# EAGLE design MIDI_Lighter_Multi-Voltage (EAGLE 7.6.0)

## Sheet 1 of 4: POWER SUPPLY
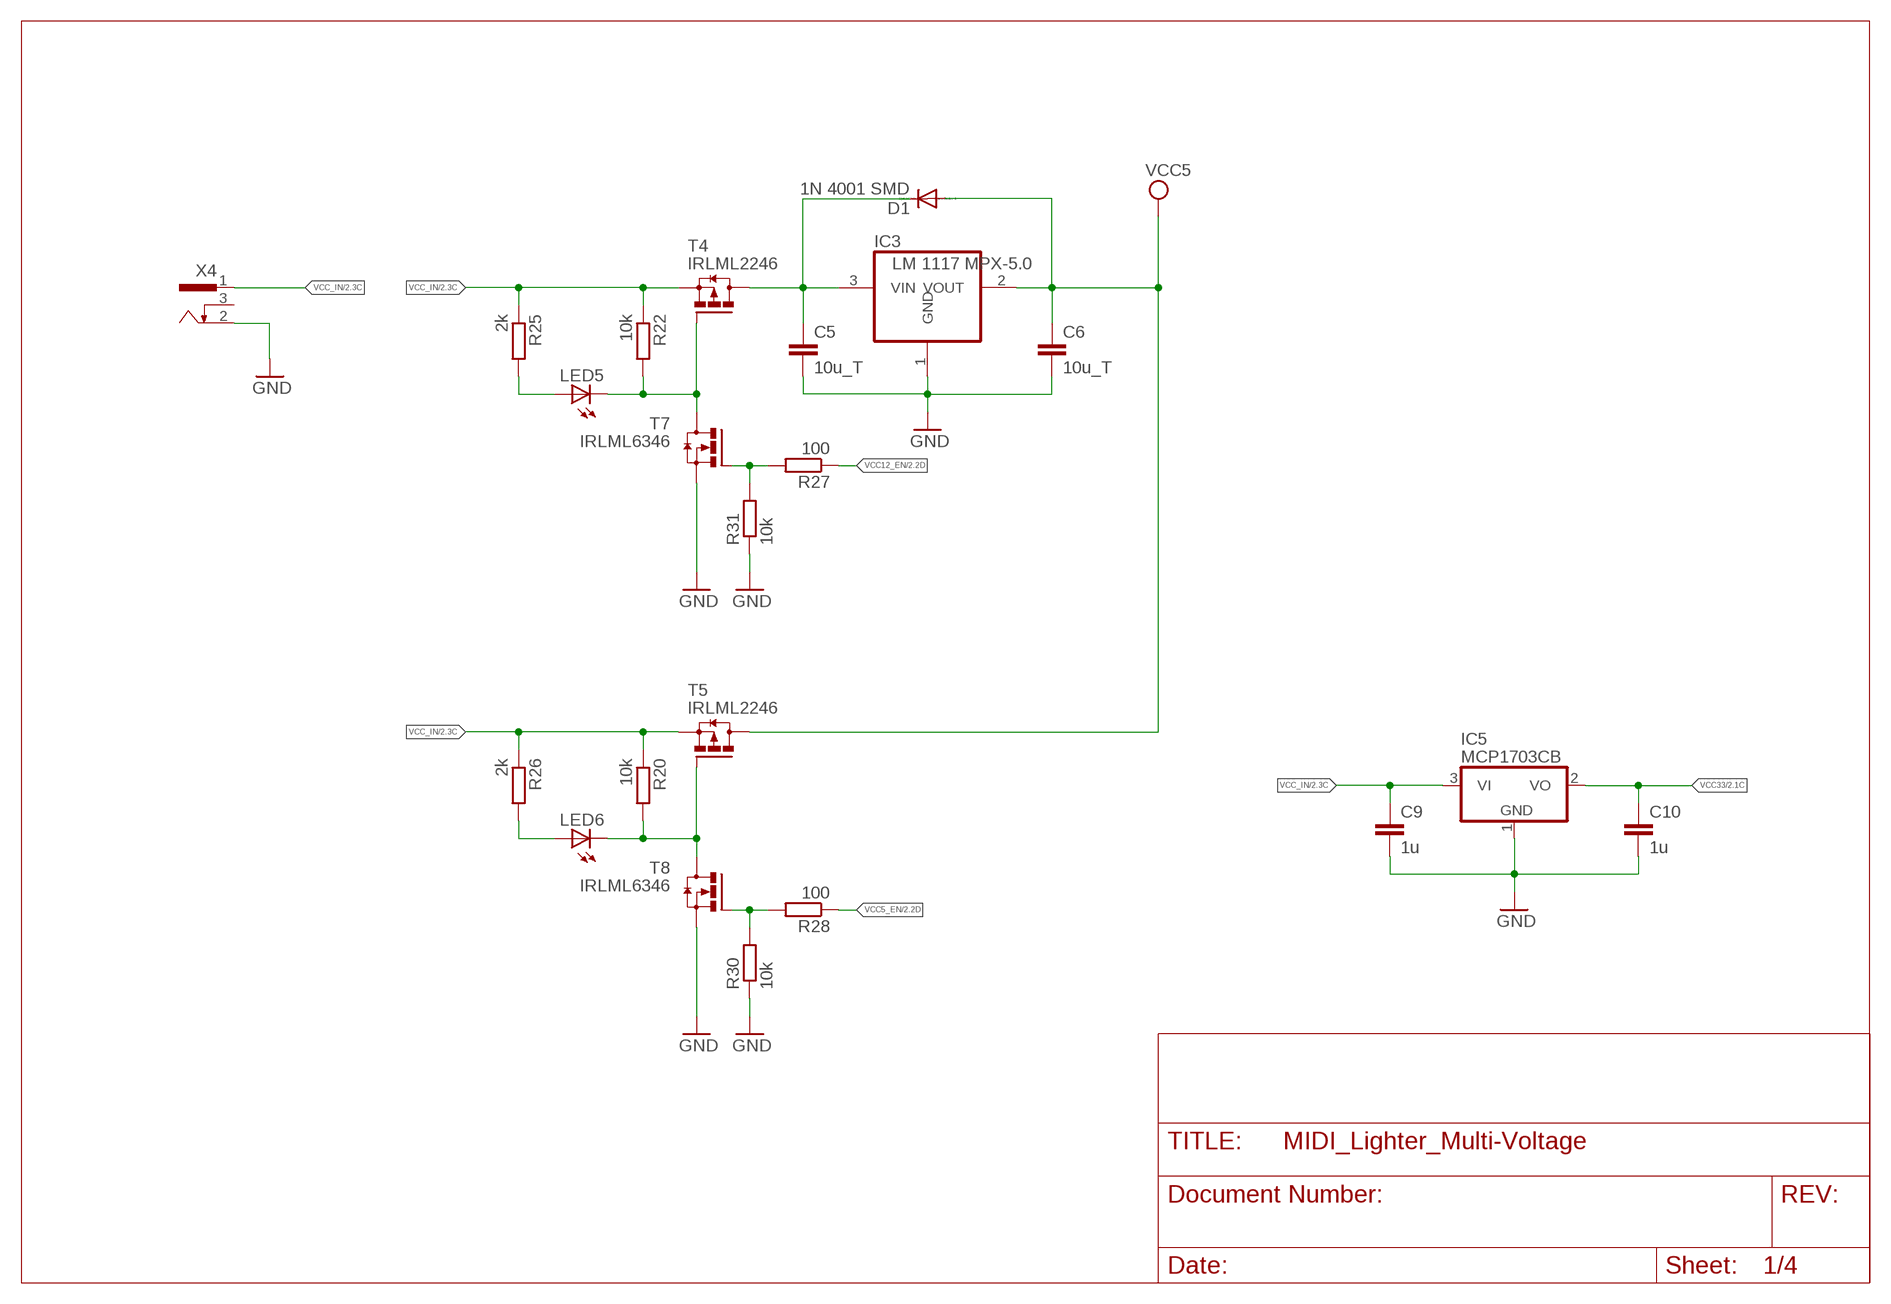
[diagram p0: schematic, sheet 1]

### Parts
C5  10u_T  C-EUC1210  [C1210]
C6  10u_T  C-EUC1210  [C1210]
C9  1u  C-EUC0805  [C0805]
C10  1u  C-EUC0805  [C0805]
D1  1N 4001 SMD  DIODE-MINIMELF  [MINIMELF]
IC3  LM 1117 MPX-5.0  REG1117  [SOT223]
IC5  MCP1703CB  [SOT23]
LED5  LEDCHIP-LED0805  [CHIP-LED0805]
LED6  LEDCHIP-LED0805  [CHIP-LED0805]
R20  10k  R-EU_R0805  [R0805]
R22  10k  R-EU_R0805  [R0805]
R25  2k  R-EU_R0805  [R0805]
R26  2k  R-EU_R0805  [R0805]
R27  100  R-EU_R0805  [R0805]
R28  100  R-EU_R0805  [R0805]
R30  10k  R-EU_R0805  [R0805]
R31  10k  R-EU_R0805  [R0805]
T4  IRLML2246  [SOT23]
T5  IRLML2246  [SOT23]
T7  IRLML6346  [SOT23]
T8  IRLML6346  [SOT23]
X4  733980-62  [733980-62]

### Nets
GND: C5.2 C6.2 C9.2 C10.2 IC3.1(GND) IC5.1(GND) R30.1 R31.1 T7.2(S) T8.2(S) X4.2 ; also sheet 2,3,4
N$9: C5.1 D1.C IC3.3(VIN) T4.3(D)
N$33: LED5.C R22.2 T4.1(G) T7.3(D)
N$35: LED6.C R20.2 T5.1(G) T8.3(D)
N$36: LED6.A R26.2
N$37: LED5.A R25.2
N$38: R27.2 R31.2 T7.1(G)
N$39: R28.2 R30.2 T8.1(G)
VCC: C6.1 D1.A IC3.2(VOUT) T5.3(D) ; supply symbol labelled VCC5 ; also sheet 2,3
VCC5_EN: R28.1 ; also sheet 2
VCC12_EN: R27.1 ; also sheet 2
VCC33: C10.1 IC5.2(VO) ; also sheet 2
VCC_IN: C9.1 IC5.3(VI) R20.1 R22.1 R25.1 R26.1 T4.2(S) T5.2(S) X4.1 ; also sheet 2,4
Unconnected: X4.3

## Sheet 2 of 4: MCU
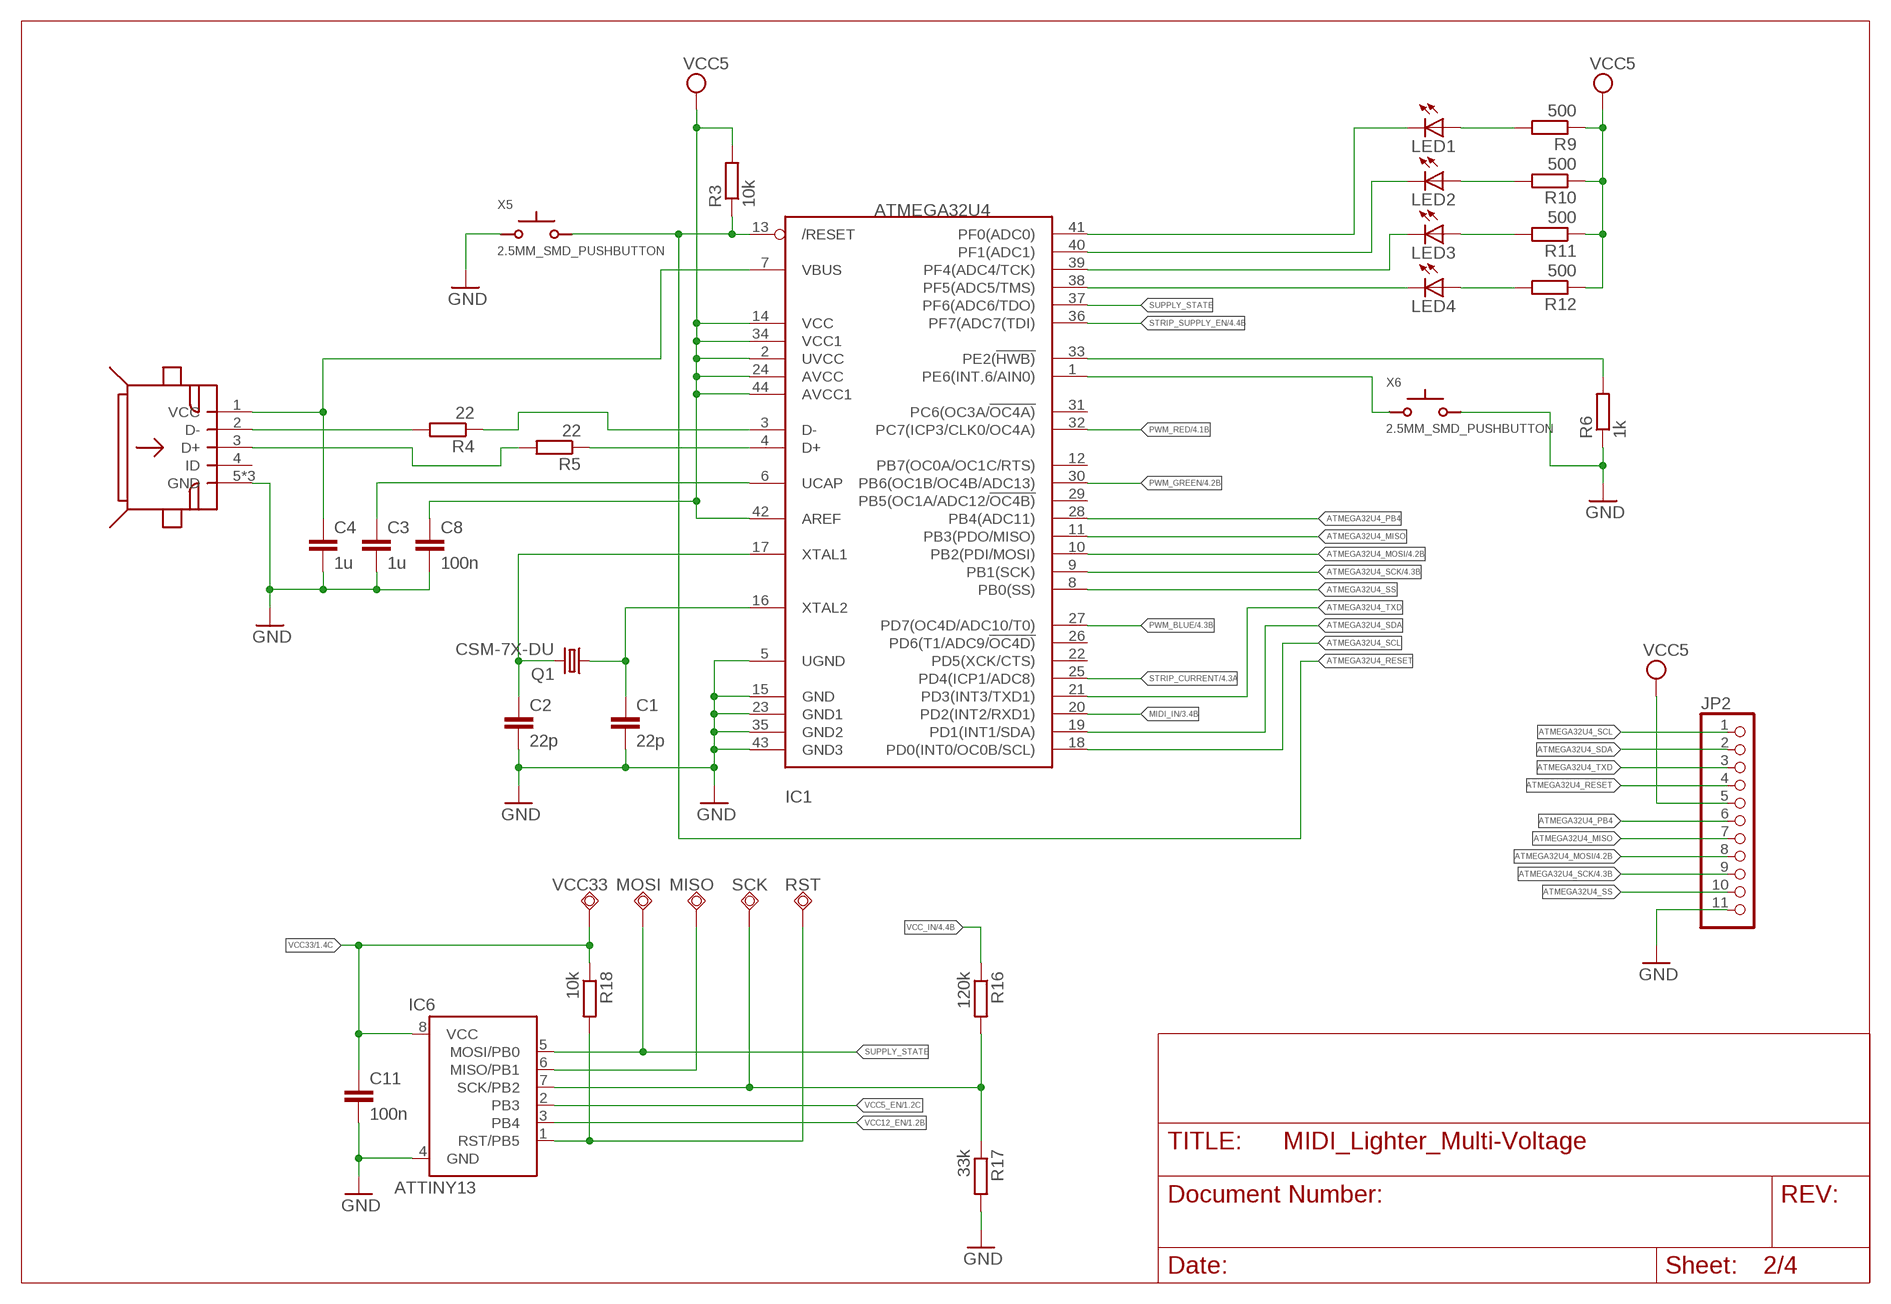
[diagram p1: schematic, sheet 2]

### Parts
C1  22p  C-EUC0805  [C0805]
C2  22p  C-EUC0805  [C0805]
C3  1u  C-EUC0805  [C0805]
C4  1u  C-EUC0805  [C0805]
C8  100n  C-EUC0805  [C0805]
C11  100n  C-EUC0805  [C0805]
IC1  ATMEGA32U4  [TQFP44]
IC6  ATTINY13  [SO08]
JP2  PINHD-1X11  [1X11]
LED1  LEDCHIP-LED0805  [CHIP-LED0805]
LED2  LEDCHIP-LED0805  [CHIP-LED0805]
LED3  LEDCHIP-LED0805  [CHIP-LED0805]
LED4  LEDCHIP-LED0805  [CHIP-LED0805]
MISO  TPSQTP13R  [TP13R]
MOSI  TPSQTP13R  [TP13R]
Q1  CSM-7X-DU  [CSM-7X-DU]
R3  10k  R-EU_R0805  [R0805]
R4  22  R-EU_R0805  [R0805]
R5  22  R-EU_R0805  [R0805]
R6  1k  R-EU_R0805  [R0805]
R9  500  R-EU_R0805  [R0805]
R10  500  R-EU_R0805  [R0805]
R11  500  R-EU_R0805  [R0805]
R12  500  R-EU_R0805  [R0805]
R16  120k  R-EU_R0805  [R0805]
R17  33k  R-EU_R0805  [R0805]
R18  10k  R-EU_R0805  [R0805]
RST  TPSQTP13R  [TP13R]
SCK  TPSQTP13R  [TP13R]
VCC33  TPSQTP13R  [TP13R]
X3  USB_MICRO_BUCHSE_LCSC  [USB_MICRO_BUCHSE_LCSC]
X5  2.5MM_SMD_PUSHBUTTON  [2.5MM_SMD_PUSHBUTTON]
X6  2.5MM_SMD_PUSHBUTTON  [2.5MM_SMD_PUSHBUTTON]

### Nets
ATMEGA32U4_MISO: IC1.11(PB3(PDO/MISO)) JP2.7
ATMEGA32U4_MOSI: IC1.10(PB2(PDI/MOSI)) JP2.8 ; also sheet 4
ATMEGA32U4_PB4: IC1.28(PB4(ADC11)) JP2.6
ATMEGA32U4_RESET: IC1.13(/RESET) JP2.4 R3.1 X5.2
ATMEGA32U4_SCK: IC1.9(PB1(SCK)) JP2.9 ; also sheet 4
ATMEGA32U4_SCL: IC1.18(PD0(INT0/OC0B/SCL)) JP2.1
ATMEGA32U4_SDA: IC1.19(PD1(INT1/SDA)) JP2.2
ATMEGA32U4_SS: IC1.8(PB0(SS)) JP2.10
ATMEGA32U4_TXD: IC1.21(PD3(INT3/TXD1)) JP2.3
GND: C1.2 C2.2 C3.2 C4.2 C8.2 C11.2 IC1.5(UGND) IC1.15(GND) IC1.23(GND1) IC1.35(GND2) IC1.43(GND3) IC6.4(GND) JP2.11 R6.1 R17.2 X3.5(GND) X3.GND1(GND) X3.GND2(GND) X5.1 X6.2 ; also sheet 1,3,4
MIDI_IN: IC1.20(PD2(INT2/RXD1)) ; also sheet 3
N$4: R4.2 X3.2(D-)
N$5: IC1.3(D-) R4.1
N$6: C1.1 IC1.16(XTAL2) Q1.1
N$7: C2.1 IC1.17(XTAL1) Q1.2
N$8: C3.1 IC1.6(UCAP)
N$10: R5.2 X3.3(D+)
N$11: IC1.4(D+) R5.1
N$12: IC1.33(PE2(!HWB)) R6.2
N$17: IC1.41(PF0(ADC0)) LED1.C
N$18: IC1.40(PF1(ADC1)) LED2.C
N$19: IC1.39(PF4(ADC4/TCK)) LED3.C
N$20: IC1.38(PF5(ADC5/TMS)) LED4.C
N$22: IC1.1(PE6(INT.6/AIN0)) X6.1
N$25: LED1.A R9.2
N$26: LED2.A R10.2
N$27: LED3.A R11.2
N$28: LED4.A R12.2
N$34: IC6.1(RST/PB5) R18.2 RST.TP
N$47: IC6.6(MISO/PB1) MISO.TP
PWM_BLUE: IC1.27(PD7(OC4D/ADC10/T0)) ; also sheet 4
PWM_GREEN: IC1.30(PB6(OC1B/OC4B/ADC13)) ; also sheet 4
PWM_RED: IC1.32(PC7(ICP3/CLK0/OC4A)) ; also sheet 4
STRIP_CURRENT: IC1.25(PD4(ICP1/ADC8)) ; also sheet 4
STRIP_SUPPLY_EN: IC1.36(PF7(ADC7(TDI)) ; also sheet 4
SUPPLY_STATE: IC1.37(PF6(ADC6/TDO)) IC6.5(MOSI/PB0) MOSI.TP
VCC: C8.1 IC1.2(UVCC) IC1.14(VCC) IC1.24(AVCC) IC1.34(VCC1) IC1.42(AREF) IC1.44(AVCC1) JP2.5 R3.2 R9.1 R10.1 R11.1 R12.1 ; supply symbol labelled VCC5 ; also sheet 1,3
VCC5_EN: IC6.2(PB3) ; also sheet 1
VCC12_EN: IC6.3(PB4) ; also sheet 1
VCC33: C11.1 IC6.8(VCC) R18.1 VCC33.TP ; also sheet 1
VCC_IN: R16.1 ; also sheet 1,4
VCC_USB: C4.1 IC1.7(VBUS) X3.1(VCC)
VOLTAGE_READ: IC6.7(SCK/PB2) R16.2 R17.1 SCK.TP
Unconnected: IC1.12(PB7(OC0A/OC1C/RTS)) IC1.22(PD5(XCK/CTS)) IC1.26(PD6(T1/ADC9/!OC4D)) IC1.29(PB5(OC1A/ADC12/!OC4B)) IC1.31(PC6(OC3A/!OC4A)) X3.4(ID)

## Sheet 3 of 4: MIDI
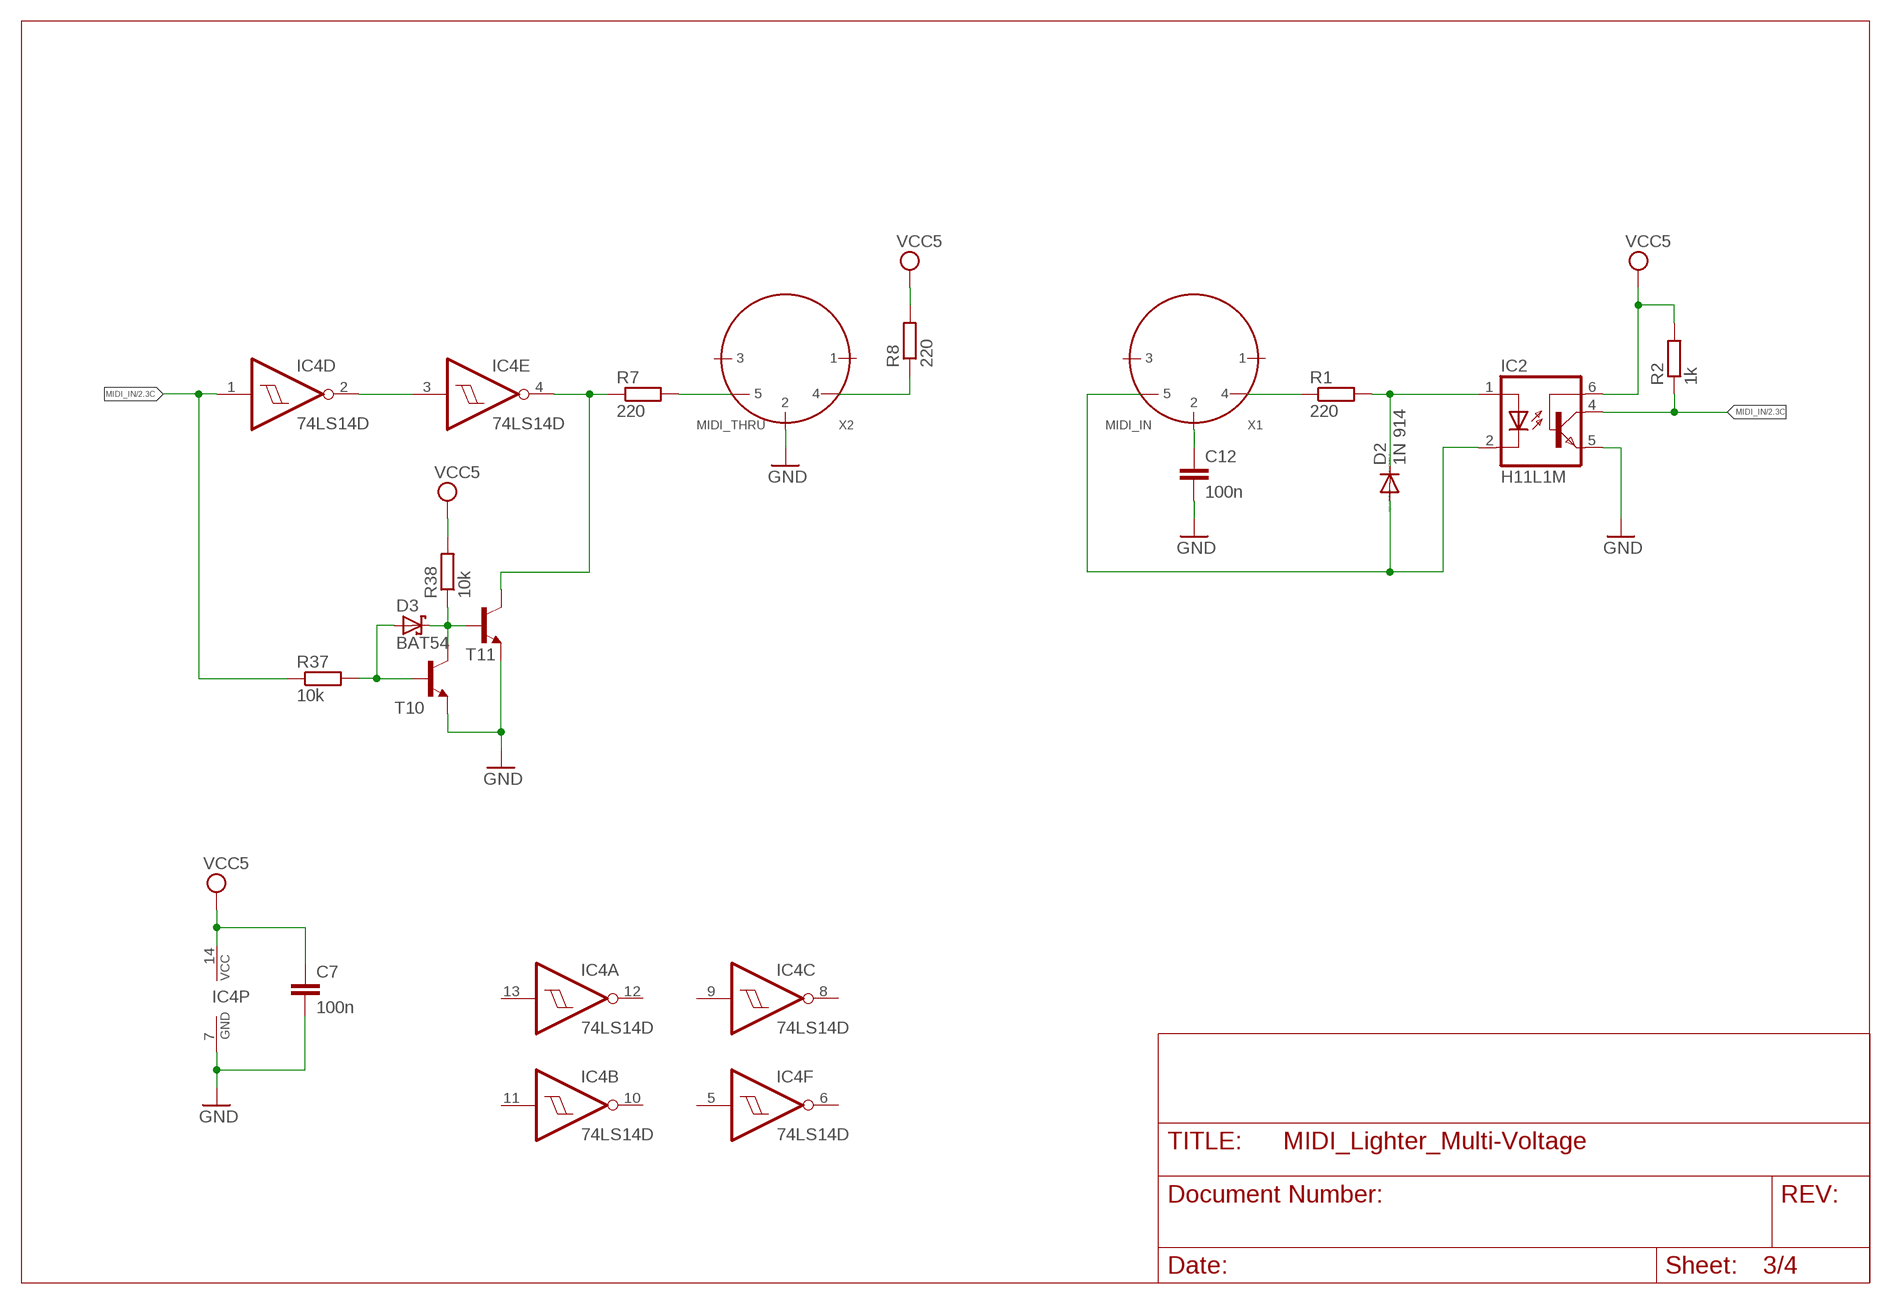
[diagram p2: schematic, sheet 3]

### Parts
C7  100n  C-EUC0805  [C0805]
C12  100n  C-EUC0805  [C0805]
D2  1N 914  DIODE-DO35-10  [DO35-10]
D3  BAT54  [SOT23]
IC2  H11L1M  [DIL06]
IC4  74LS14D  [SO14]
R1  220  R-EU_R0805  [R0805]
R2  1k  R-EU_R0805  [R0805]
R7  220  R-EU_R0805  [R0805]
R8  220  R-EU_R0805  [R0805]
R37  10k  R-EU_R0805  [R0805]
R38  10k  R-EU_R0805  [R0805]
T10  BC847CLT1-NPN-SOT23-BEC  [SOT23-BEC]
T11  BC847CLT1-NPN-SOT23-BEC  [SOT23-BEC]
X1  MIDI_IN  DIN_PLUG_5_PINS  [DIN_PLUG_5_PINS]
X2  MIDI_THRU  DIN_PLUG_5_PINS  [DIN_PLUG_5_PINS]

### Nets
GND: C7.2 C12.2 IC2.5(GND) IC4.7(P:GND) T10.E T11.E X2.2 ; also sheet 1,2,4
MIDI_IN: IC2.4(VO) IC4.1(D:I) R2.1 R37.1 ; also sheet 2
N$1: D2.C IC2.1(A) R1.2
N$2: R1.1 X1.4
N$3: D2.A IC2.2(C) X1.5
N$13: IC4.2(D:O) IC4.3(E:I)
N$15: R7.2 X2.5
N$16: R8.1 X2.4
N$40: C12.1 X1.2
N$44: D3.1(A) R37.2 T10.B
N$46: D3.3(C) R38.1 T10.C T11.B
N$49: IC4.4(E:O) R7.1 T11.C
VCC: C7.1 IC2.6(VCC) IC4.14(P:VCC) R2.2 R8.2 R38.2 ; supply symbol labelled VCC5 ; also sheet 1,2
Unconnected: IC4.5(F:I) IC4.6(F:O) IC4.8(C:O) IC4.9(C:I) IC4.10(B:O) IC4.11(B:I) IC4.12(A:O) IC4.13(A:I) X1.1 X1.3 X2.1 X2.3

## Sheet 4 of 4
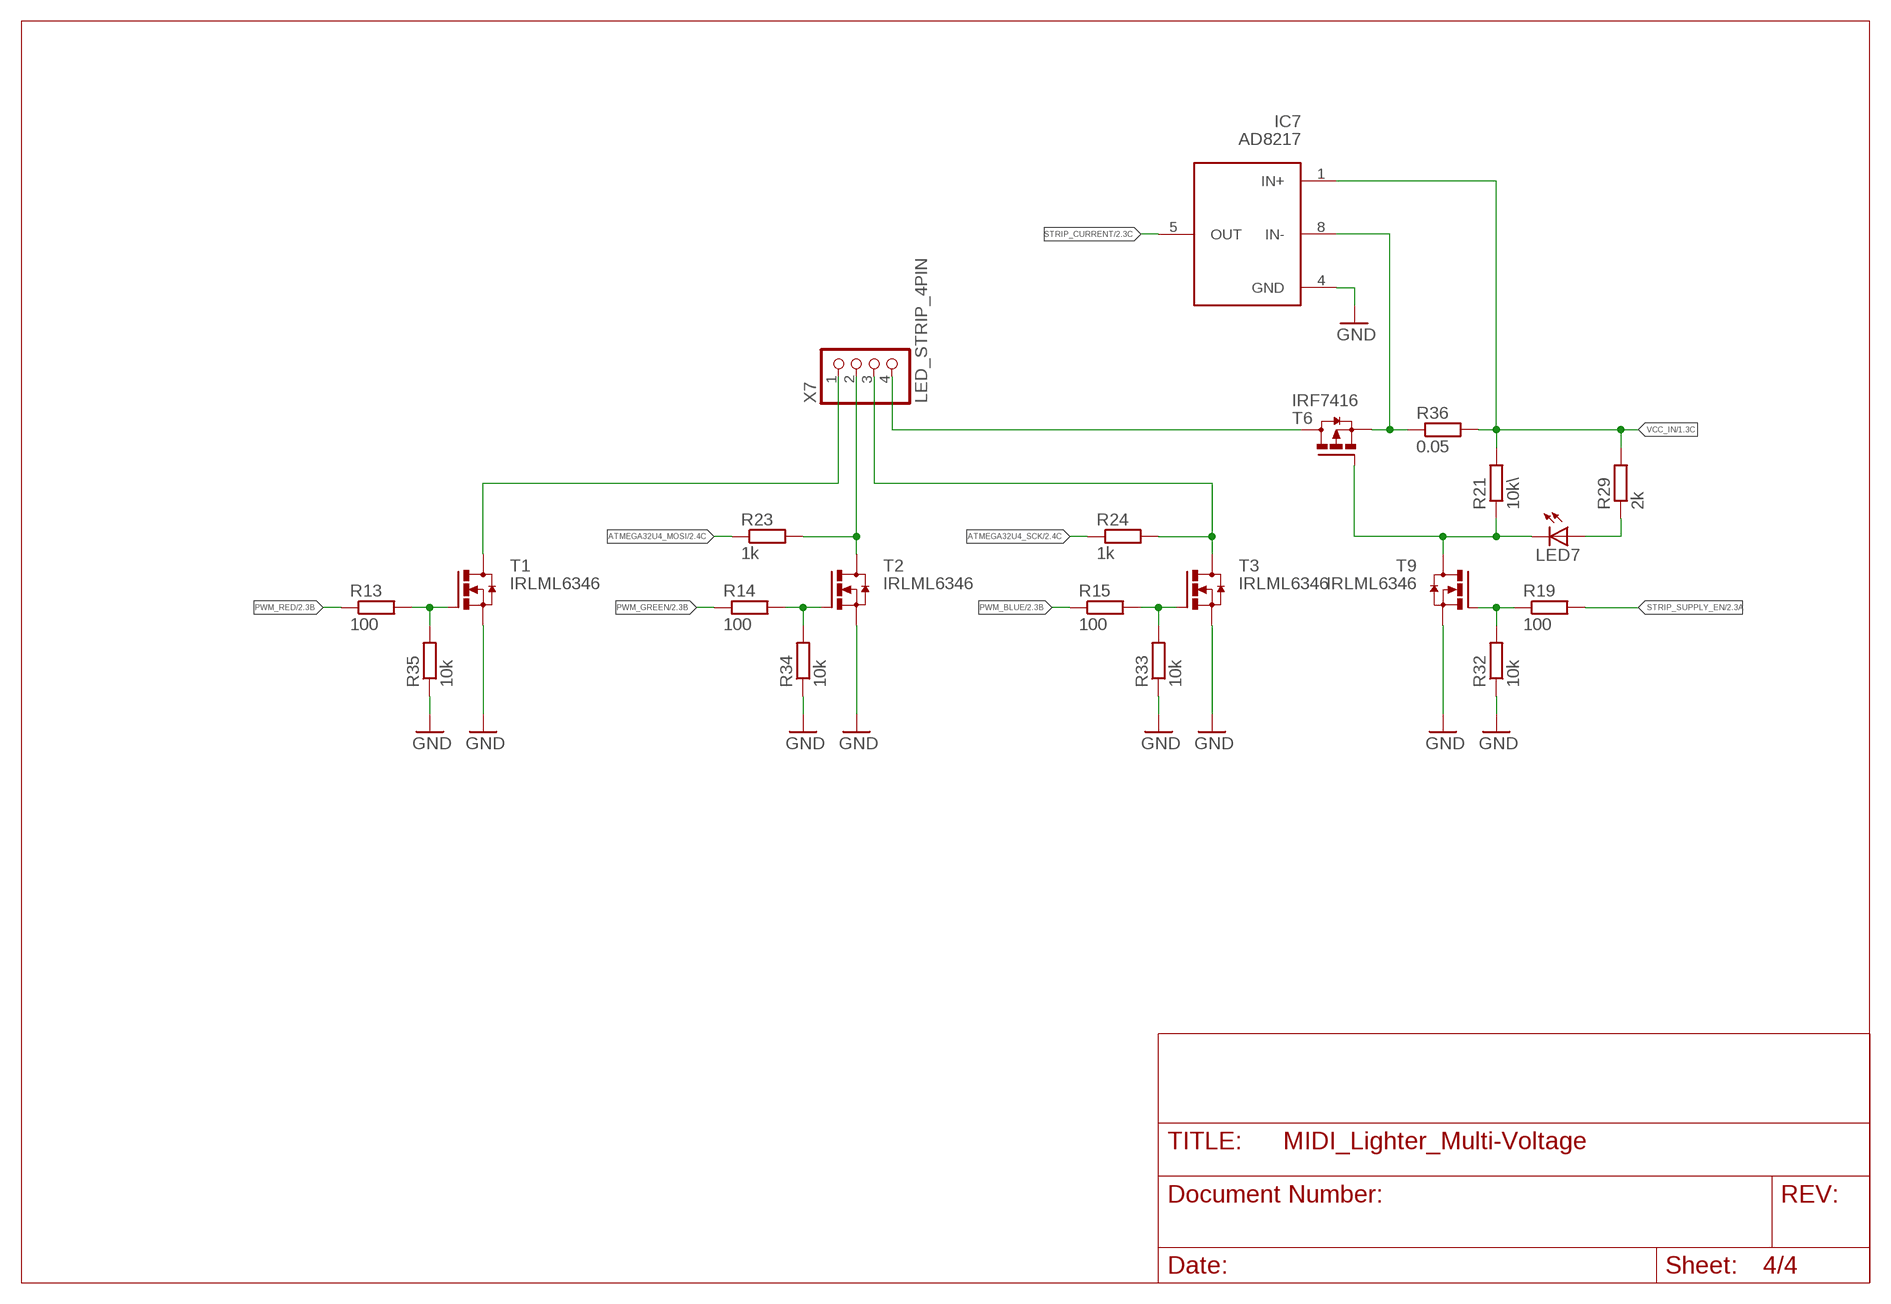
[diagram p3: schematic, sheet 4]

### Parts
IC7  AD8217  [SO08]
LED7  LEDCHIP-LED0805  [CHIP-LED0805]
R13  100  R-EU_R0805  [R0805]
R14  100  R-EU_R0805  [R0805]
R15  100  R-EU_R0805  [R0805]
R19  100  R-EU_R0805  [R0805]
R21  10k\  R-EU_R0805  [R0805]
R23  1k  R-EU_R0805  [R0805]
R24  1k  R-EU_R0805  [R0805]
R29  2k  R-EU_R0805  [R0805]
R32  10k  R-EU_R0805  [R0805]
R33  10k  R-EU_R0805  [R0805]
R34  10k  R-EU_R0805  [R0805]
R35  10k  R-EU_R0805  [R0805]
R36  0.05  R-EU_R2512  [R2512]
T1  IRLML6346  [SOT23]
T2  IRLML6346  [SOT23]
T3  IRLML6346  [SOT23]
T6  IRF7416  [SO08]
T9  IRLML6346  [SOT23]
X7  LED_STRIP_4PIN  [LED_STRIP_4PIN]

### Nets
ATMEGA32U4_MOSI: R23.1 ; also sheet 2
ATMEGA32U4_SCK: R24.1 ; also sheet 2
GND: IC7.4(GND) R32.1 R33.1 R34.1 R35.1 T1.2(S) T2.2(S) T3.2(S) T9.2(S) ; also sheet 1,2,3
N$21: R13.2 R35.2 T1.1(G)
N$23: R14.2 R34.2 T2.1(G)
N$24: R15.2 R33.2 T3.1(G)
N$29: R23.2 T2.3(D) X7.2
N$30: T1.3(D) X7.1
N$31: R24.2 T3.3(D) X7.3
N$32: T6.5(D) T6.6(D) T6.7(D) T6.8(D) X7.4
N$41: LED7.C R21.1 T6.4(G) T9.3(D)
N$42: R19.1 R32.2 T9.1(G)
N$43: LED7.A R29.1
N$45: IC7.8(IN-) R36.1 T6.1(S) T6.2(S) T6.3(S)
PWM_BLUE: R15.1 ; also sheet 2
PWM_GREEN: R14.1 ; also sheet 2
PWM_RED: R13.1 ; also sheet 2
STRIP_CURRENT: IC7.5(OUT) ; also sheet 2
STRIP_SUPPLY_EN: R19.2 ; also sheet 2
VCC_IN: IC7.1(IN+) R21.2 R29.2 R36.2 ; also sheet 1,2

## Library data of the parts
C1-C4 C7-C12 = resistor:C-EU: CAPACITOR, European symbol
C5 C6 = resistor:C-EU: CAPACITOR, European symbol; REICHELT: TPS 3225 10/20
D1 D2 = diode:DIODE-: DIODE
D3 = diode:BAT54: Schottky Diodes Source: Fairchild .. BAT54.pdf
IC1 = ChrosLib:ATMEGA32U4; REICHELT: ATXMEGA 32A4U-AU
IC2 = ChrosLib:H11L1M
IC3 = burr-brown:REG1117: 800mA and 1A Low Dropout (LDO) Positive Regulator 1.8V, 2.5V, 2.85V, 3.3V, 5V, and Adj; MPN: REG1117; OC_FARNELL: 1097566; OC_NEWARK: 14P6981
IC4 = 74xx-eu:74*14: Hex schmitt trigger INVERTER
IC5 = linear:MCP1703: 250 mA, 16V, Low Quiescent Current LDO Regulator Source: http://ww1.microchip.com/downloads/en/DeviceDoc/22049b.pdf
IC6 = ChrosLib:ATTINY13; REICHELT: ATTINY 13A-SSU
IC7 = ChrosLib:AD8217
JP2 = pinhead:PINHD-1X11: PIN HEADER
LED1-LED7 = led:LED: LED OSRAM: - CHIPLED LG R971, LG N971, LY N971, LG Q971, LY Q971, LO R971, LY R971 LH N974, LH R974 LS Q976, LO Q976, LY Q976 LO Q996 - Hyper CHIPLED LW Q18S LB Q993, LB Q99A, LB R99A - SideLED LS A670, LO A670, LY A670, LG A670, LP A670 LB A673, LV A673, LT A673, LW A673 LH A674 LY A675 LS A676, LA A676, LO A676, LY A676, LW A676 LS A679, LY A679, LG A679 - Hyper Micro SIDELED® LS Y876, LA Y876, LO Y876, LY Y876 LT Y87S - SmartLED LW L88C, LW L88S LB L89C, LB L89S, LG L890 LS L89K, LO L89K, LY L89K LS L896, LA L896, LO L896, LY L896 - TOPLED LS T670, LO T670, LY T670, LG T670, LP T670 LSG T670, LSP T670, LSY T670, LOP T670, LYG T670 LG T671, LOG T671, LSG T671 LB T673, LV T673, LT T673, LW T673 LH T674 LS T676, LA T676, LO T676, LY T676, LB T676, LH T676, LSB T676, LW T676 LB T67C, LV T67C, LT T67C, LS T67K, LO T67K, LY T67K, LW E67C LS E67B, LA E67B, LO E67B, LY E67B, LB E67C, LV E67C, LT E67C LW T67C LS T679, LY T679, LG T679 LS T770, LO T770, LY T770, LG T770, LP T770 LB T773, LV T773, LT T773, LW T773 LH T774 LS E675, LA E675, LY E675, LS T675 LS T776, LA T776, LO T776, LY T776, LB T776 LHGB T686 LT T68C, LB T68C - Hyper Mini TOPLED® LB M676 - Mini TOPLED Santana® LG M470 LS M47K, LO M47K, LY M47K Source: http://www.osram.convergy.de LUXEON: - LUMILED® LXK2-PW12-R00, LXK2-PW12-S00, LXK2-PW14-U00, LXK2-PW14-V00 LXK2-PM12-R00, LXK2-PM12-S00, LXK2-PM14-U00 LXK2-PE12-Q00, LXK2-PE12-R00, LXK2-PE12-S00, LXK2-PE14-T00, LXK2-PE14-U00 LXK2-PB12-K00, LXK2-PB12-L00, LXK2-PB12-M00, LXK2-PB14-N00, LXK2-PB14-P00, LXK2-PB14-Q00 LXK2-PR12-L00, LXK2-PR12-M00, LXK2-PR14-Q00, LXK2-PR14-R00 LXK2-PD12-Q00, LXK2-PD12-R00, LXK2-PD12-S00 LXK2-PH12-R00, LXK2-PH12-S00 LXK2-PL12-P00, LXK2-PL12-Q00, LXK2-PL12-R00 Source: www.luxeon.com KINGBRIGHT: KA-3528ASYC Source: www.kingbright.com
MISO MOSI RST SCK VCC33 = testpad:TPSQ: Test pad
Q1 = crystal:CSM-7X-DU: SMD CRYSTAL Source: www.ecsxtal.com .. Crystal 3.6864MHz CSM_7X_DU.PDF; OC_FARNELL: unknown; OC_NEWARK: unknown
R1-R38 = resistor:R-EU_: RESISTOR, European symbol
T1-T3 T7-T9 = ChrosLib:IRLML6346; REICHELT: IRLML 6346
T4 T5 = ChrosLib:IRLML2246
T6 = ChrosLib:IRF7416
T10 T11 = transistor:*-NPN-: NPN Transistror BF959 corrected 2008.03.06
X1 X2 = ChrosLib:DIN_PLUG_5_PINS; REICHELT: MABPM 5S
X3 = ChrosLib:USB_MICRO_BUCHSE_LCSC
X4 = con-conrad:73398?: FEMALE PRINT CONNECTOR Niedervolt-Steckverbinder Distributor Conrad
X5 X6 = ChrosLib:2.5MM_SMD_PUSHBUTTON
X7 = ChrosLib:LED_STRIP_4PIN

## Board
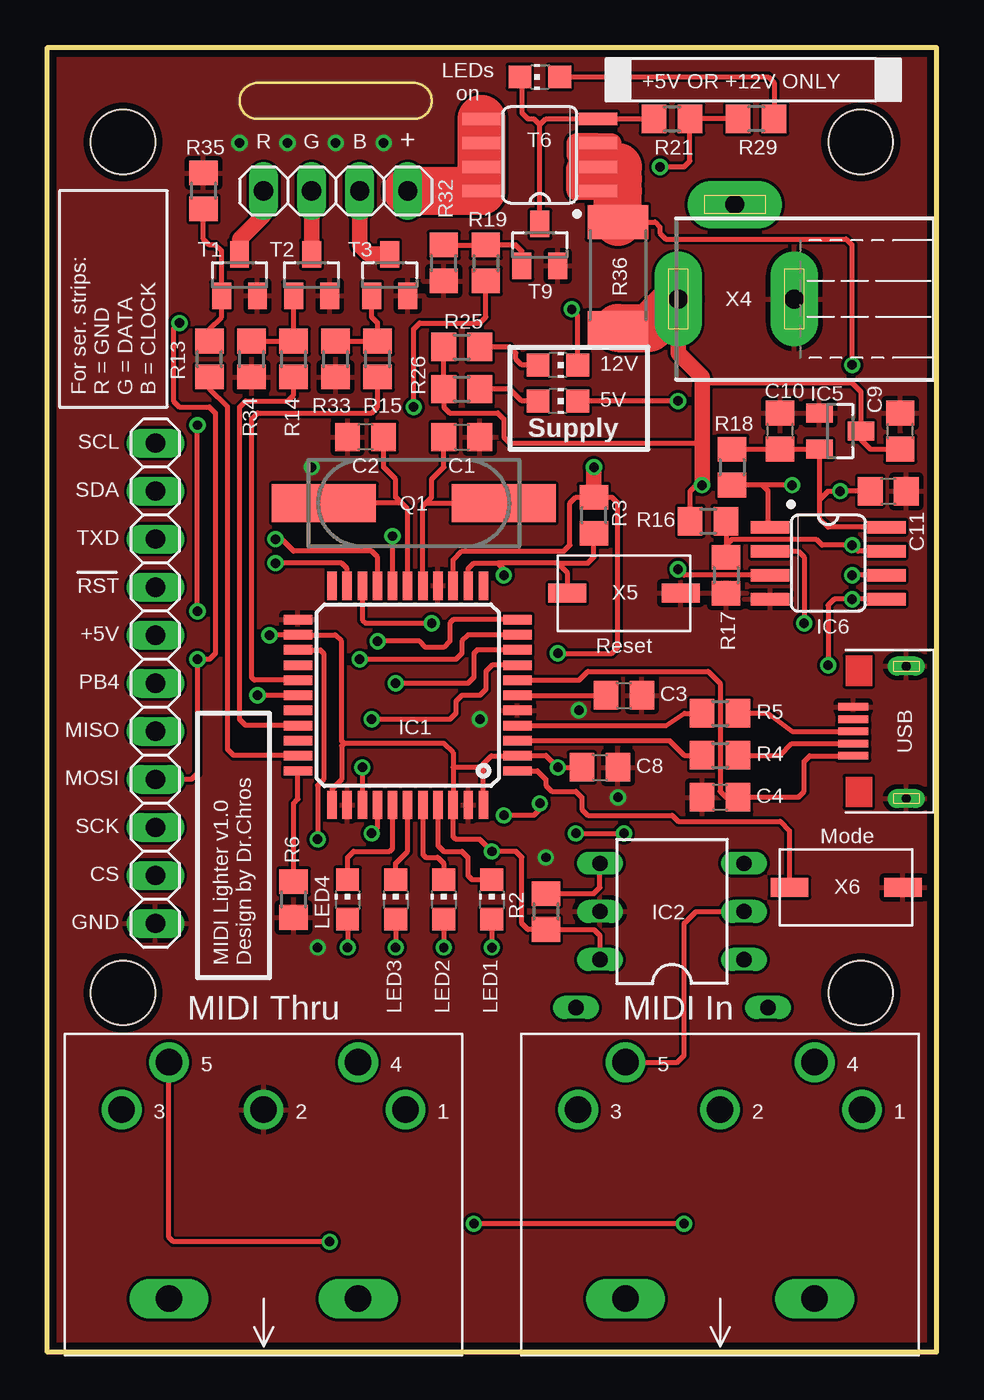
[diagram p4: board, top side]
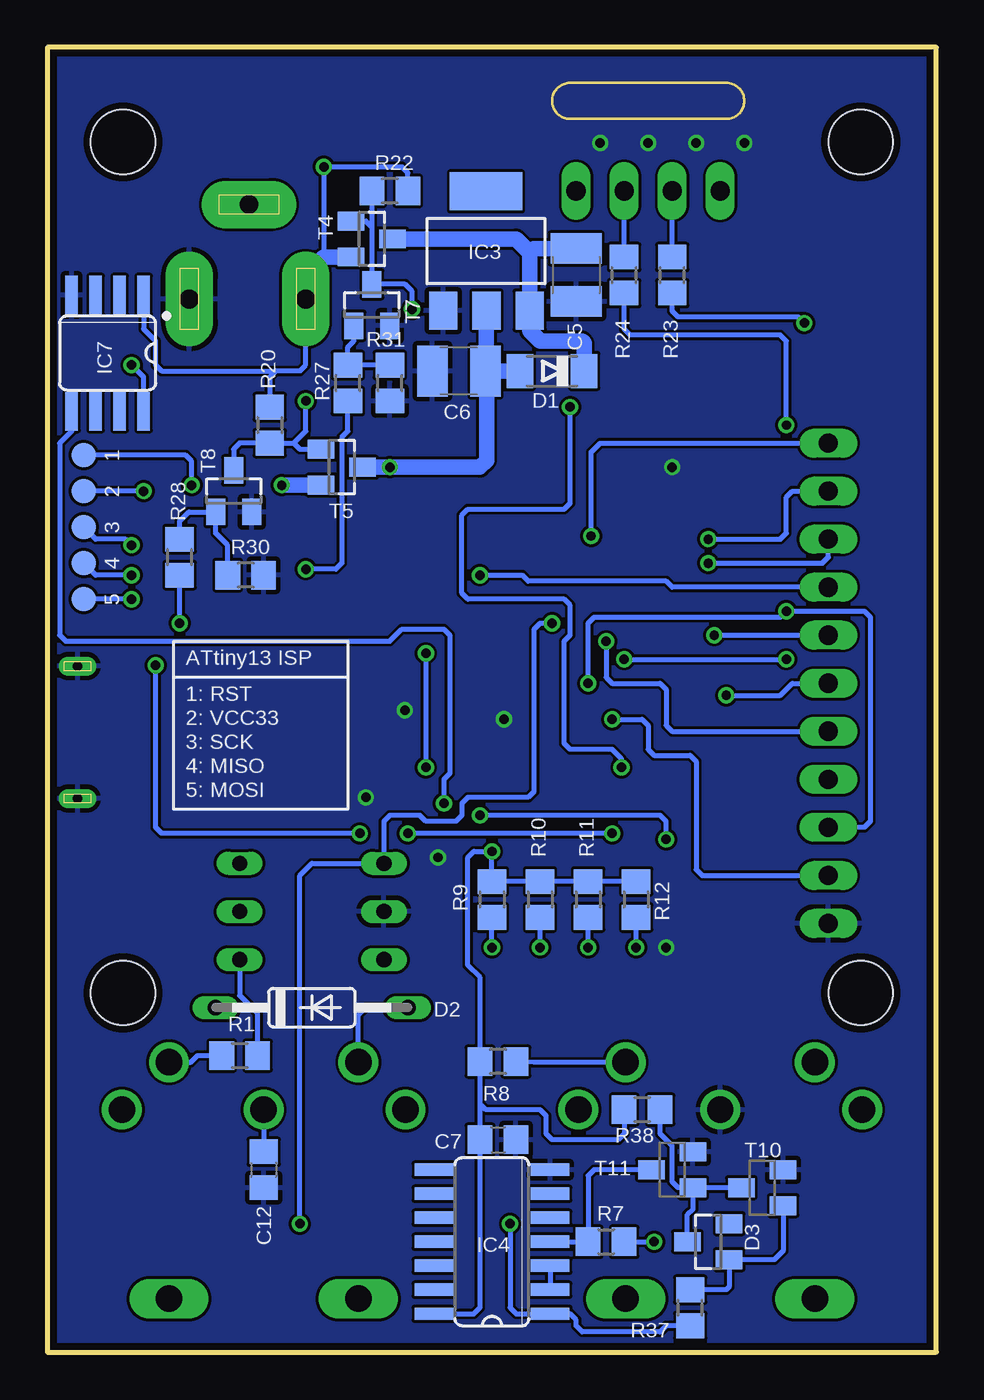
[diagram p5: board, bottom side, seen from below]

Size 47 x 69 mm. Coordinates in mm from the lower left corner, seen from the top.
Outline: 0,0 0,69 47,69 47,0 0,0
Copper layers (1*16): Top 0.0356mm / dielectric 1.5011mm / Bottom 0.0356mm
Design rules "OSH-Park": minimum track width 6mil, minimum drill 13mil, track to track 6mil, track to pad 6mil, pad to pad 6mil, via to via 6mil, smd to smd 6mil, copper to edge 15mil, drill to drill 6mil, minimum pad ring 7mil, minimum via ring 7mil, stop-mask expansion 3mil, vias tented up to drill 0mil, thermal gap 10mil
Holes 3.4 mm at 4,64 43,64 4,19 43,19

### Footprints (pad centres in the part's own frame; a part is rotated, then mirrored left to right if it is on the bottom)
C0805 = smd 1.3 x 1.5: 1 -0.95,0; 2 0.95,0
C1210 = smd 1.6 x 2.7: 1 -1.4,0; 2 1.4,0
MINIMELF = smd 1.4 x 1.8: A 1.7,0; C -1.7,0
DO35-10 = drill 0.813 long: A 5.08,0; C -5.08,0
SOT23 = smd 1 x 1.4: 1 -0.95,-1.1; 2 0.95,-1.1; 3 0,1.1
TQFP44 = smd 1.5 x 0.5: 1 -5.8,4; 2 -5.8,3.2; 3 -5.8,2.4; 4 -5.8,1.6; 5 -5.8,0.8; 6 -5.8,0; 7 -5.8,-0.8; 8 -5.8,-1.6; 9 -5.8,-2.4; 10 -5.8,-3.2; 11 -5.8,-4; 23 5.8,-4; 24 5.8,-3.2; 25 5.8,-2.4; 26 5.8,-1.6; 27 5.8,-0.8; 28 5.8,0; 29 5.8,0.8; 30 5.8,1.6; 31 5.8,2.4; 32 5.8,3.2; 33 5.8,4 | smd 0.5 x 1.5: 12 -4,-5.8; 13 -3.2,-5.8; 14 -2.4,-5.8; 15 -1.6,-5.8; 16 -0.8,-5.8; 17 0,-5.8; 18 0.8,-5.8; 19 1.6,-5.8; 20 2.4,-5.8; 21 3.2,-5.8; 22 4,-5.8; 34 4,5.8; 35 3.2,5.8; 36 2.4,5.8; 37 1.6,5.8; 38 0.8,5.8; 39 0,5.8; 40 -0.8,5.8; 41 -1.6,5.8; 42 -2.4,5.8; 43 -3.2,5.8; 44 -4,5.8
DIL06 = drill 0.813 long: 1 -2.54,-3.81; 2 0,-3.81; 3 2.54,-3.81; 4 2.54,3.81; 5 0,3.81; 6 -2.54,3.81
SOT223 = smd 1.499 x 2.007: 1 -2.261,-3.15; 2 0.025,-3.15; 3 2.311,-3.15 | smd 3.81 x 2.007: 4 0,3.15
SO14 = smd 0.66 x 2.032: 1 -3.81,-3.073; 2 -2.54,-3.073; 3 -1.27,-3.073; 4 0,-3.073; 5 1.27,-3.073; 6 2.54,-3.073; 7 3.81,-3.073; 8 3.81,3.073; 9 2.54,3.073; 10 1.27,3.073; 11 0,3.073; 12 -1.27,3.073; 13 -2.54,3.073; 14 -3.81,3.073
SO08 = smd 0.66 x 2.032: 1 -1.905,-3.073; 2 -0.635,-3.073; 3 0.635,-3.073; 4 1.905,-3.073; 5 1.905,3.073; 6 0.635,3.073; 7 -0.635,3.073; 8 -1.905,3.073
1X11 = drill 1.016 long: 1 -12.7,0; 2 -10.16,0; 3 -7.62,0; 4 -5.08,0; 5 -2.54,0; 6 0,0; 7 2.54,0; 8 5.08,0; 9 7.62,0; 10 10.16,0; 11 12.7,0
CHIP-LED0805 = smd 1.2 x 1.2: A 0,-1.05; C 0,1.05
TP13R = smd 1.3 x 1.3: TP 0,0
CSM-7X-DU = smd 5.5 x 2: 1 -4.75,0; 2 4.75,0
R0805 = smd 1.3 x 1.5: 1 -0.95,0; 2 0.95,0
R2512 = smd 1.8 x 3.2: 1 -2.8,0; 2 2.8,0
SOT23-BEC = smd 1 x 1.4: B -0.95,-1.1; C 0,1.1; E 0.95,-1.1
DIN_PLUG_5_PINS = drill 1.4: 1 7.5,0; 2 0,0; 3 -7.5,0; 4 5,2.5; 5 -5,2.5 | drill 1.4 long: NC1 -5,-10; NC2 5,-10
USB_MICRO_BUCHSE_LCSC = smd 0.4 x 1.6: 1 -1.3,2.8; 2 -0.65,2.8; 3 0,2.8; 4 0.65,2.8; 5 1.3,2.8 | drill 0.5 pad 1 long: GND1 -3.55,0; GND2 3.45,0
733980-62 = drill 1 pad 2.5 long: 1 0,8.57; 2 0,2.42; 3 5,5.57
2.5MM_SMD_PUSHBUTTON = smd 2 x 1: 1 -3,0; 2 3,0
LED_STRIP_4PIN = drill 1.016 long: 1 -3.81,0; 2 -1.27,0; 3 1.27,0; 4 3.81,0

### Placement (x,y rotation side)
C1  21.91,48.39 0 top
C2  16.83,48.39 180 top
C3  30.48,34.73 0 top
C4  35.56,29.34 180 top
C5  19.05,56.96 270 bottom
C6  25.24,51.88 180 bottom
C7  23.18,11.24 0 bottom
C8  29.21,30.92 0 top
C9  45.09,48.7 90 top
C10  38.73,48.7 90 top
C11  44.45,45.53 0 top
C12  35.56,9.65 270 bottom
D1  20.32,51.88 180 bottom
D2  33.02,18.23 0 bottom
D3  12.06,5.84 90 bottom
IC1  19.05,34.73 180 top
IC2  33.02,23.3 90 top
IC3  23.81,58.23 0 bottom
IC4  23.5,5.84 90 bottom
IC5  41.91,48.7 270 top
IC6  41.27,41.72 270 top
IC7  43.81,52.83 180 bottom
JP2  5.71,35.37 270 top
LED1  23.5,23.94 0 top
LED2  20.95,23.94 0 top
LED3  18.41,23.94 0 top
LED4  15.88,23.94 0 top
LED5  26.99,52.2 270 top
LED6  26.99,50.29 270 top
LED7  26.04,67.44 90 top
MISO  45.09,41.72 0 bottom
MOSI  45.09,39.81 0 bottom
Q1  19.37,44.9 180 top
R1  36.83,15.68 0 bottom
R2  26.35,23.3 270 top
R3  28.89,44.26 90 top
R4  35.56,31.56 0 top
R5  35.56,33.78 0 top
R6  13.02,23.94 90 top
R7  17.46,5.84 0 bottom
R8  23.18,15.37 180 bottom
R9  23.5,23.94 270 bottom
R10  20.95,23.94 270 bottom
R11  18.41,23.94 270 bottom
R12  15.88,23.94 270 bottom
R13  8.57,52.52 90 top
R14  13.02,52.52 90 top
R15  17.46,52.52 90 top
R16  34.92,43.94 0 top
R17  35.88,41.09 270 top
R18  36.2,46.8 270 top
R19  23.18,57.59 270 top
R20  35.24,49.02 270 bottom
R21  33.02,65.22 0 top
R22  28.89,61.41 180 bottom
R23  13.97,56.96 90 bottom
R24  16.51,56.96 90 bottom
R25  21.91,53.15 0 top
R26  21.91,50.93 0 top
R27  31.11,51.24 90 bottom
R28  40.01,42.04 90 bottom
R29  37.47,65.22 180 top
R30  36.51,41.09 180 bottom
R31  28.89,51.24 90 bottom
R32  20.95,57.59 90 top
R33  15.24,52.52 90 top
R34  10.79,52.52 90 top
R35  8.26,61.41 270 top
R36  30.16,56.96 270 top
R37  13.02,2.35 90 bottom
R38  15.56,12.83 180 bottom
RST  45.09,47.44 0 bottom
SCK  45.09,43.62 0 bottom
T1  10.16,56.96 0 top
T2  13.97,56.96 0 top
T3  18.1,56.96 0 top
T4  29.84,58.87 270 bottom
T5  31.43,46.8 270 bottom
T6  26.04,63.31 90 top
T7  29.84,55.37 0 bottom
T8  37.15,45.53 0 bottom
T9  26.04,58.55 0 top
T10  9.21,8.7 90 bottom
T11  13.97,9.65 90 bottom
VCC33  45.09,45.53 0 bottom
X1  35.56,12.83 0 top
X2  11.43,12.83 0 top
X3  45.4,32.83 90 top
X4  41.91,55.69 90 top
X5  30.48,40.13 180 top
X6  42.23,24.57 0 top
X7  15.24,61.41 0 top

### Tracks (layer width: path | path; a pad name or v marks a point on that pad's centre or on a via)
ATMEGA32U4_MISO  (via drill 0.5 pad 0.25)
  Top 0.254: IC1.11 21.46,38.73 21.27,38.55 21.27,37.59 20.95,37.27 20,37.27 19.68,37.59 v17.46,37.59
  Bottom 0.254: v17.46,37.59 17.46,35.69 17.14,35.37 14.61,35.37 14.29,35.05 14.29,33.15 13.97,32.83 JP2.7
ATMEGA32U4_MOSI  (via drill 0.5, 0.5 pad 0.25)
  Top 0.254: IC1.10 22.25,37.94 21.91,37.59 21.91,36.96 21.59,36.64 v16.51,36.64 | JP2.8 7.62,30.29 7.94,30.61 v7.94,36.64 8.57,36.64 8.89,36.96 8.89,49.66 8.57,49.98 6.99,49.98 6.67,50.29 6.67,54.1 v6.99,54.42
  Bottom 0.254: v16.51,36.64 v7.94,36.64 | R23.1 13.97,55.05 13.65,54.74 7.3,54.74 v6.99,54.42
ATMEGA32U4_PB4  (via drill 0.5 pad 0.25)
  Top 0.254: IC1.28 v11.11,34.73
  Bottom 0.254: v11.11,34.73 8.26,34.73 7.62,35.37 JP2.6
ATMEGA32U4_RESET  (via drill 0.5 pad 0.25)
  Top 0.254: IC1.13 22.25,41.43 22.54,41.72 23.81,41.72 | 26.99,41.72 27.48,41.23 X5.2 | 26.99,41.72 28.57,41.72 28.89,42.04 R3.1 | 23.81,41.72 24.13,41.4 v24.13,41.09 | 26.99,41.72 23.81,41.72
  Bottom 0.254: v24.13,41.09 21.91,41.09 21.59,40.77 14.29,40.77 13.97,40.45 JP2.4
ATMEGA32U4_SCK  (via drill 0.5, 0.5 pad 0.25)
  Top 0.254: IC1.9 22.72,37.13 22.54,36.96 22.54,35.69 22.23,35.37 v18.41,35.37 | v7.94,39.18 v7.94,49.02
  Bottom 0.254: v18.41,35.37 18.41,38.55 18.1,38.86 8.26,38.86 v7.94,39.18 3.81,39.18 3.49,38.86 3.49,28.07 3.81,27.75 JP2.9 | R24.1 16.51,54.1 16.19,53.78 8.26,53.78 7.94,53.47 v7.94,49.02
ATMEGA32U4_SCL  (via drill 0.5 pad 0.25)
  Top 0.254: IC1.18 v18.25,43.16
  Bottom 0.254: v18.25,43.16 18.25,47.6 17.78,48.07 JP2.1
ATMEGA32U4_SDA  (via drill 0.5 pad 0.25)
  Top 0.254: IC1.19 17.46,40.55 17.46,42.04 17.14,42.35 13.02,42.35 12.38,42.99 v12.06,42.99
  Bottom 0.254: v12.06,42.99 8.26,42.99 7.94,43.31 7.94,45.21 7.62,45.53 JP2.2
ATMEGA32U4_SS  (via drill 0.5 pad 0.25)
  Top 0.254: IC1.8 23.51,36.34 23.18,36.01 23.18,35.05 22.86,34.73 21.91,34.73 21.59,34.42 21.59,33.78 21.27,33.47 v17.14,33.47
  Bottom 0.254: v17.14,33.47 15.56,33.47 15.24,33.15 15.24,31.88 14.92,31.56 13.02,31.56 12.7,31.24 12.7,25.53 12.38,25.21 JP2.10
ATMEGA32U4_TXD  (via drill 0.5 pad 0.25)
  Top 0.254: IC1.21 15.85,41.43 15.56,41.72 v12.06,41.72
  Bottom 0.254: v12.06,41.72 6.03,41.72 5.71,42.04 JP2.3
GND  (via drill 0.5)
  Top 0.254: 44.94,49.8 C9.2
  other vias: 28.1,33.94 22.86,33.47 26.35,26.16 14.29,21.4 30.16,29.34 10.16,63.94 12.7,63.94 15.24,63.94 17.78,63.94 13.97,46.8
  pour Top: 0,0 0,69 47,69 47,0
  pour Bottom: 0,0 0,69 47,69 47,0
MIDI_IN  (via drill 0.5 pad 0.25)
  Top 0.254: IC1.20 16.65,38.72 16.83,38.55 v20.32,38.55 | v33.66,6.79 v22.54,6.79 | R2.1 28.57,24.25 28.57,24.26 28.89,24.26 29.21,24.57 IC2.4
  Bottom 0.254: v33.66,6.79 33.66,25.21 33.02,25.84 IC2.4 29.21,28.07 28.89,28.38 27.3,28.38 26.99,28.07 25.4,28.07 25.08,28.38 25.08,29.02 24.77,29.34 21.59,29.34 21.27,29.66 21.27,38.23 20.95,38.55 v20.32,38.55 | v22.54,6.79 22.54,2.35 22.23,2.03 IC4.1 19.37,2.03 19.05,1.71 19.05,1.4 18.89,1.24 18.73,1.08 | 18.73,1.08 | R37.1 14.29,1.4 14.61,1.08 18.73,1.08
N$1
  Bottom 0.254: R1.2 35.88,17.91 36.2,18.23 | 36.2,18.23 D2.C | IC2.1 36.83,18.86 36.2,18.23
N$2
  Bottom 0.254: X1.4 39.41,15.33 39.05,15.68 R1.1
N$3
  Top 0.254: X1.5 33.3,15.33 33.66,15.68 33.66,22.67 34.29,23.3 IC2.2
  Bottom 0.254: X1.5 30.56,17.83 30.16,18.23 D2.A
N$4
  Top 0.254: R4.2 38.73,31.56 39.35,32.18 X3.2
N$5
  Top 0.254: IC1.3 32.88,32.34 33.66,31.56 R4.1
N$6
  Top 0.254: 20,44.9 Q1.1 | IC1.16 19.85,44.74 20,44.9 | 20,44.9 20.32,45.21 20.32,46.16 20.96,46.8 C1.1
N$7
  Top 0.254: IC1.17 19.05,44.58 18.73,44.9 | 18.73,44.9 Q1.2 | 18.73,44.9 18.41,45.21 18.41,46.16 17.78,46.8 C2.1
N$8
  Top 0.254: IC1.6 C3.1
N$9
  Bottom 0.813: T4.3 22.23,58.87 21.5,58.14 | 21.5,58.14 IC3.3 21.5,54.01 20.95,53.47 18.73,53.47 18.62,53.35 D1.C | C5.1 21.28,58.36 21.5,58.14
N$10
  Top 0.254: X3.3 39.37,32.83 38.1,33.78 R5.2
N$11
  Top 0.254: IC1.4 32.72,33.13 33.68,33.78 R5.1
N$12
  Top 0.254: R6.2 13.02,29.02 13.25,29.25 IC1.33
N$13
  Bottom 0.254: IC4.3 IC4.2
N$15  (via drill 0.5)
  Top 0.254: v14.92,5.84 6.67,5.84 6.43,6.08 X2.5
  Bottom 0.254: R7.2 v14.92,5.84
N$16
  Bottom 0.254: X2.4 21.27,15.33 R8.1
N$17
  Top 0.254: IC1.41 20.65,26.79 20.95,26.48 21.91,26.48 22.23,26.16 22.23,25.21 22.45,24.99 LED1.C
N$18
  Top 0.254: IC1.40 19.85,26.32 20,26.16 20.64,26.16 20.95,25.84 LED2.C
N$19
  Top 0.254: IC1.39 19.05,26.48 18.41,25.84 LED3.C
N$20
  Top 0.254: IC1.38 18.25,26.63 18.1,26.48 16.19,26.48 15.88,26.16 LED4.C
N$21
  Top 0.254: R13.2 8.57,54.1 9.21,54.74 T1.1 9.21,58.23 8.89,58.55 8.57,58.55 8.26,58.87 R35.2
N$22
  Top 0.254: IC1.1 25.91,30.73 26.35,30.29 26.35,29.97 26.67,29.66 27.94,29.66 28.26,29.34 28.26,28.7 28.57,28.38 33.02,28.38 33.34,28.07 38.73,28.07 39.23,27.57 X6.1
N$23
  Top 0.254: T2.1 R14.2 R34.2
N$24
  Top 0.254: T3.1 17.15,54.73 17.46,54.42 R15.2 R33.2
N$25  (via drill 0.5 pad 0.25)
  Top 0.254: LED1.A v23.5,21.4
  Bottom 0.254: v23.5,21.4 R9.2
N$26  (via drill 0.5 pad 0.25)
  Top 0.254: LED2.A v20.95,21.4
  Bottom 0.254: v20.95,21.4 R10.2
N$27  (via drill 0.5 pad 0.25)
  Top 0.254: LED3.A v18.41,21.4
  Bottom 0.254: v18.41,21.4 R11.2
N$28  (via drill 0.5 pad 0.25)
  Top 0.254: LED4.A v15.88,21.4
  Bottom 0.254: v15.88,21.4 R12.2
N$29
  Top 0.813: T2.3 X7.2
  Bottom 0.254: R23.2 X7.2
N$30
  Top 0.813: T1.3 10.16,58.87 11.43,60.14 X7.1
N$31
  Top 0.813: T3.3 17,58.06 16.51,58.55 X7.3
  Bottom 0.254: R24.2 X7.3
N$32
  Top 2.54: X7.4 T6.8 T6.7 T6.6 T6.5
N$33  (via drill 0.5 pad 0.25)
  Top 0.254: LED5.C 28.04,54.84 v27.72,55.15
  Bottom 0.254: T4.1 30.16,59.81 29.84,59.5 | 29.84,59.5 T7.3 | R22.2 29.84,59.5 | 29.8,56.42 T7.3 | v27.72,55.15 27.72,56.1 28.09,56.47 T7.3
N$34  (via drill 0.5)
  Top 0.254: IC6.1 38.1,43.73 38.1,45.53 37.78,45.85 | v39.37,45.85 37.78,45.85 | 37.78,45.85 R18.2
  Bottom 0.254: v39.37,45.85 39.37,47.12 39.69,47.44 RST.TP
N$35  (via drill 0.5 pad 0.25)
  Top 0.254: v33.34,50.29 LED6.C
  Bottom 0.254: T8.3 37.15,47.75 36.83,48.07 R20.2 33.97,48.07 | v33.34,50.29 33.34,48.7 33.97,48.07 | 33.97,48.07 33.65,47.75 T5.1
N$36
  Top 0.254: LED6.A 25.08,50.29 24.45,50.93 R26.2
N$37
  Top 0.254: LED5.A 25.08,52.2 24.77,52.52 24.77,52.83 24.45,53.15 R25.2
N$38
  Bottom 0.254: R31.2 R27.2 31.11,53.15 30.8,53.47 T7.1
N$39
  Bottom 0.254: R28.2 40.01,43.94 39.52,44.43 T8.1 38.1,43.3 37.47,42.67 R30.2
N$40
  Bottom 0.254: X1.2 C12.1
N$41
  Top 0.254: T9.3 26.04,64.9 | 26.04,64.9 26.35,65.22 T6.4 R21.1 | LED7.C 25.08,67.34 25.08,65.53 25.4,65.22 25.72,65.22 26.04,64.9
N$42
  Top 0.254: T9.1 25.08,58.23 24.77,58.55 R19.1 R32.2
N$43
  Top 0.254: LED7.A 38.1,67.44 38.41,67.12 R29.1
N$44
  Bottom 0.254: T10.B 8.11,5.36 8.57,4.89 D3.1 10.96,3.45 11.11,3.3 R37.2 13.02,2.99
N$45  (via drill 0.5)
  Top 0.254: R36.1 32.12,59.76 32.38,59.5 32.38,59.18 32.7,58.87 42.23,58.87 42.55,58.55 v42.55,52.2
  Top 1.016: 29.84,63.94 T6.3 27.94,63.94 27.94,63.31 30.16,63.31 30.16,62.67 T6.2 27.94,62.67 27.94,62.04 | 27.94,62.04 27.94,61.41 T6.1 30.16,61.41 | 30.16,62.04 27.94,62.04
  Top 2.54: R36.1 30.16,61.41 30.16,62.04 30.16,62.67
  Bottom 0.254: IC7.8 41.91,51.56 v42.55,52.2
N$46
  Bottom 0.254: T10.C T11.B | D3.3 13.16,7.28 12.87,7.58 T11.B | T11.B 13.65,8.7 13.97,9.02 13.97,10.92 14.61,11.56 R38.1
N$47  (via drill 0.5)
  Top 0.254: IC6.6 v42.55,41.09
  Bottom 0.254: v42.55,41.09 44.45,41.09 MISO.TP
N$49
  Bottom 0.254: IC4.4 R7.1 18.41,9.34 18.1,9.65 T11.C
PWM_BLUE
  Top 0.254: IC1.27 10.95,35.53 10.79,35.69 10.79,49.34 11.11,49.66 17.14,49.66 17.46,49.98 R15.1
PWM_GREEN
  Top 0.254: IC1.30 13.24,33.15 10.48,33.15 10.16,33.47 10.16,49.98 10.48,50.29 12.7,50.29 13.02,50.61 R14.1
PWM_RED
  Top 0.254: IC1.32 13.22,31.56 9.84,31.56 9.53,31.88 9.53,49.98 8.57,50.93 R13.1
STRIP_CURRENT  (via drill 0.5)
  Top 0.254: IC1.25 14.43,37.13 14.61,36.96 14.61,30.29 14.29,29.97 v14.29,27.11 | 24.45,28.38 v24.13,28.38 25.72,28.38 26.04,28.7 v26.04,29.02
  Bottom 0.254: IC7.5 45.72,48.7 46.35,48.07 46.35,37.91 46.04,37.59 28.89,37.59 28.26,38.23 26.04,38.23 25.72,37.91 25.72,30.61 26.04,30.29 v26.04,29.02 | v14.29,27.11 14.29,28.07 14.61,28.38 v24.13,28.38
STRIP_SUPPLY_EN  (via drill 0.5 pad 0.25)
  Top 0.254: v16.65,30.92 IC1.36 | IC1.36 | v19.37,49.98 19.37,54.1 19.68,54.42 22.86,54.42 23.18,54.74 R19.2
  Bottom 0.254: v16.65,30.92 16.65,31.38 17.14,31.88 19.37,31.88 19.68,32.2 19.68,37.59 19.37,37.91 19.37,39.5 19.68,39.81 24.77,39.81 25.08,40.13 25.08,44.26 24.77,44.58 19.68,44.58 19.37,44.9 v19.37,49.98
SUPPLY_STATE  (via drill 0.5, 0.5 pad 0.25)
  Top 0.254: IC1.37 17.45,27.74 v17.14,27.43 | v27.94,27.43 v30.48,27.43 | v41.27,36.32 41.27,39.5 41.59,39.81 v42.55,39.81 IC6.5
  Bottom 0.254: v17.14,27.43 v27.94,27.43 | v41.27,36.32 41.27,27.75 40.96,27.43 v30.48,27.43 | v42.55,39.81 MOSI.TP
VCC  (via drill 0.5 pad 0.25)
  Top 0.254: IC1.2 24.88,31.56 26.35,31.56 v26.99,30.92 C8.1 | IC1.14 21.45,41.9 21.91,42.35 27.3,42.35 27.62,42.67 27.62,44.9 27.94,45.21 R3.2 29.85,45.21 30.16,44.9 30.16,37.27 29.84,36.96 v26.99,36.96 | IC1.44 23.05,30.73 | 23.05,30.73 22.86,30.92 21.45,30.92 | 21.45,30.92 21.45,31.7 20.95,32.2 15.69,32.2 | 21.45,30.92 IC1.42 21.45,27.25 21.59,27.11 22.86,27.11 v23.5,26.48 24.77,26.48 25.08,26.16 25.08,22.67 25.4,22.35 R2.2 28.89,22.35 29.21,22.04 IC2.6 | IC1.2 24.82,31.56 24.77,31.56 | 23.05,30.73 23.05,31.12 23.47,31.53 IC1.2 | v11.75,37.91 13.22,37.91 IC1.24 15.21,37.94 15.56,37.59 15.56,32.32 15.69,32.2 | 15.69,32.2 15.56,32.07 15.56,30.29 15.05,29.78 IC1.34
  Top 0.813: R3.2 v28.89,46.8
  Bottom 0.254: IC4.14 24.45,2.03 24.13,2.35 C7.1 | R12.1 R11.1 R10.1 R9.1 v23.5,26.48 24.45,26.48 24.77,26.16 24.77,20.45 24.13,19.81 R8.2 24.13,13.14 | v26.99,36.96 v26.99,30.92 | 24.13,13.14 C7.1 | C7.1 | v11.75,37.91 JP2.5 | R38.2 16.51,11.56 16.83,11.24 20.32,11.24 20.64,11.56 20.64,12.51 20.95,12.83 23.81,12.83 24.13,13.14
  Bottom 0.813: T5.3 v28.89,46.8 24.13,46.8 23.78,47.15 23.78,51.82 C6.1 | IC3.2 23.79,51.93 C6.1 | C6.1 D1.A
VCC5_EN  (via drill 0.5)
  Top 0.254: IC6.2 39.69,42.35 40.01,42.04 v40.01,38.55
  Bottom 0.254: R28.1 v40.01,38.55
VCC12_EN  (via drill 0.5)
  Top 0.254: IC6.3 33.66,41.09 v33.34,41.4
  Bottom 0.254: 30.8,50.29 R27.1 31.11,48.7 31.43,48.39 31.43,41.72 31.75,41.4 v33.34,41.4
VCC33  (via drill 0.5 pad 0.25)
  Top 0.254: 40.81,45.06 IC5.2 C10.1 R18.1 | 40.81,45.06 40.81,44.09 41.27,43.62 IC6.8 | 40.81,45.06 41.27,45.53 v41.91,45.53 C11.1
  Bottom 0.254: v41.91,45.53 VCC33.TP
VCC_IN  (via drill 0.5, 0.5 pad 0.25)
  Top 0.254: C9.1 43.49,47.76 43.01,48.24 IC5.3 43.01,50.78 42.55,51.24 34.92,51.24 34.61,50.93 | R16.1 33.97,43.63 33.97,45.53 34.29,45.85 v34.61,45.85 | R25.1 R26.1 20.96,49.97 21.27,49.66 23.81,49.66 24.13,49.34 24.13,48.39 24.45,48.07 34.61,48.07 | R29.2 R21.2 33.97,62.99 33.66,62.67 v32.38,62.67
  Top 0.813: v34.61,45.85 34.61,48.07 34.61,50.93 34.61,51.56 33.34,52.83 X4.1
  Top 2.54: R36.2 31.81,54.16 X4.1
  Bottom 0.254: 34.92,51.88 33.66,51.88 33.34,52.2 X4.1 | 34.92,51.88 35.24,51.56 R20.1 | R22.1 27.94,62.36 28.26,62.67 v32.38,62.67 32.38,57.91 | IC7.1 41.91,54.1 41.27,53.47 41.27,52.2 40.96,51.88 34.92,51.88
  Bottom 0.813: T4.2 32.38,57.91 33.34,56.96 X4.1 | T5.2 33.49,45.85 v34.61,45.85
VCC_USB
  Top 0.254: X3.1 40.29,31.53 40.01,31.24 40.01,29.66 39.69,29.34 C4.1 35.88,29.34 35.56,29.66 35.56,35.37 34.92,36.01 28.57,36.01 28.11,35.53 IC1.7
VOLTAGE_READ  (via drill 0.5 pad 0.25)
  Top 0.254: R16.2 35.88,43.62 R17.1 35.88,42.67 36.2,42.99 40.64,42.99 40.96,42.67 v42.55,42.67 42.86,42.35 IC6.7
  Bottom 0.254: v42.55,42.67 42.86,42.99 44.45,42.99 SCK.TP

### Text on the board
tPlace: +5V OR +12V ONLY | LEDs / on | R | G | B | + | 12V | For ser. strips: / R = GND / G = DATA / B = CLOCK | 5V | SCL | Supply | SDA | TXD | RST | +5V | Reset | PB4 | MISO | USB | MOSI | SCK | Mode | CS | GND | MIDI Lighter v1.0 / Design by Dr.Chros | MIDI Thru | MIDI In
bPlace: 1 | 2 | 3 | 4 | 5 | ATtiny13 ISP | 1: | 2: | 3: | 4: | 5: